# EAGLE design placa2caras_V1718 (EAGLE 7.6.0)
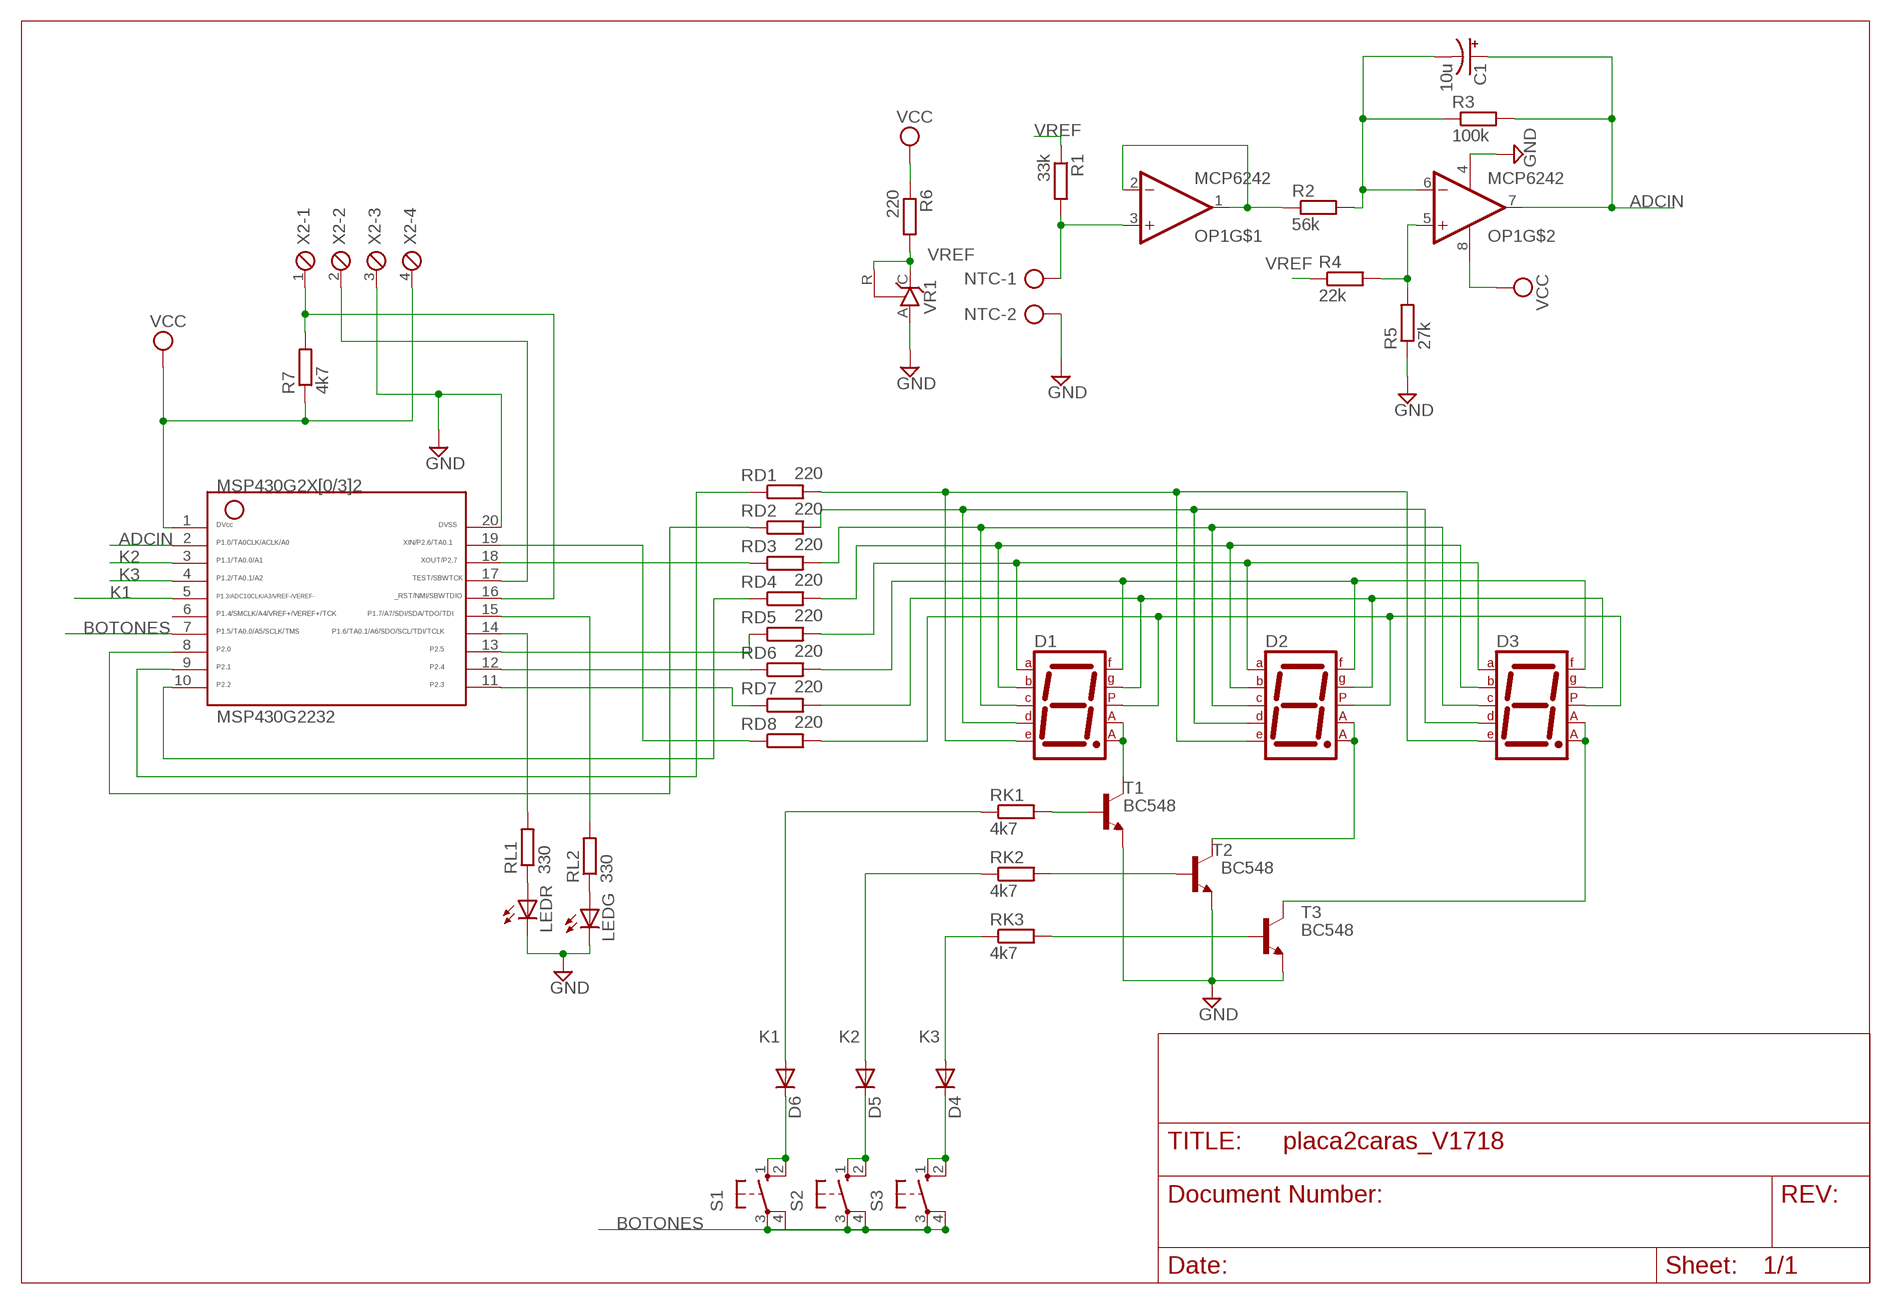
[diagram p0: schematic, sheet 1]

## Parts
C1  10u  CPOL-USE2,5-6E  [E2,5-6E]
D1  7SEG-CA  [7SEG-13]
D2  7SEG-CA  [7SEG-13]
D3  7SEG-CA  [7SEG-13]
D4  1N4148DO35-10  [DO35-10]
D5  1N4148DO35-10  [DO35-10]
D6  1N4148DO35-10  [DO35-10]
LEDG  LED5MM  [LED5MM]
LEDR  LED5MM  [LED5MM]
MSP430G2232  G2X[0/3]2---N20  [N20]
NTC  AK500/2  [AK500/2]
OP1  MCP6242  MCP6242CONPADGORDO  [DIL8_MOD]
R1  33k  R-EU_0207/10  [0207/10]
R2  56k  R-EU_0207/10  [0207/10]
R3  100k  R-EU_0207/10  [0207/10]
R4  22k  R-EU_0207/10  [0207/10]
R5  27k  R-EU_0207/10  [0207/10]
R6  220  R-EU_0207/10  [0207/10]
R7  4k7  R-EU_0207/10  [0207/10]
RD1  220  R-EU_0207/10  [0207/10]
RD2  220  R-EU_0207/10  [0207/10]
RD3  220  R-EU_0207/10  [0207/10]
RD4  220  R-EU_0207/10  [0207/10]
RD5  220  R-EU_0207/10  [0207/10]
RD6  220  R-EU_0207/10  [0207/10]
RD7  220  R-EU_0207/10  [0207/10]
RD8  220  R-EU_0207/10  [0207/10]
RK1  4k7  R-EU_0207/10  [0207/10]
RK2  4k7  R-EU_0207/10  [0207/10]
RK3  4k7  R-EU_0207/10  [0207/10]
RL1  330  R-EU_0207/10  [0207/10]
RL2  330  R-EU_0207/10  [0207/10]
S1  10-XX  [B3F-10XX]
S2  10-XX  [B3F-10XX]
S3  10-XX  [B3F-10XX]
T1  BC548  [TO92-EBC]
T2  BC548  [TO92-EBC]
T3  BC548  [TO92-EBC]
VR1  TL431CLP  [TO92-CLP]
X2  MPT4  [4POL254]

## Nets
ADCIN: C1.+ MSP430G2232.2 OP1.7(OUT) R3.2
BOTONES: MSP430G2232.7 S1.3(P) S1.4(P1) S2.3(P) S2.4(P1) S3.3(P) S3.4(P1)
GND: LEDG.K(C) LEDR.K(C) MSP430G2232.20 NTC.2 OP1.4(V-) R5.1 T1.E T2.E T3.E VR1.A X2.3
K1: D6.A MSP430G2232.5 RK1.1
K2: D5.A MSP430G2232.3 RK2.1
K3: D4.A MSP430G2232.4 RK3.1
N$1: RK1.2 T1.B
N$2: RK2.2 T2.B
N$3: RK3.2 T3.B
N$4: D1.7(A) D2.7(A) D3.7(A) RD5.2
N$5: D1.3(CA1) D1.8(CA2) T1.C
N$6: D1.6(B) D2.6(B) D3.6(B) RD4.2
N$7: D2.3(CA1) D2.8(CA2) T2.C
N$8: D1.4(C) D2.4(C) D3.4(C) RD3.2
N$9: D3.3(CA1) D3.8(CA2) T3.C
N$10: D1.2(D) D2.2(D) D3.2(D) RD2.2
N$11: MSP430G2232.17 X2.2
N$12: D1.1(E) D2.1(E) D3.1(E) RD1.2
N$13: OP1.5(+IN) R4.2 R5.2
N$14: D1.9(F) D2.9(F) D3.9(F) RD6.2
N$15: NTC.1 OP1.3(+IN) R1.2
N$16: D1.10(G) D2.10(G) D3.10(G) RD7.2
N$17: OP1.1(OUT) OP1.2(-IN) R2.1
N$18: D1.5(DP) D2.5(DP) D3.5(DP) RD8.2
N$19: C1.- OP1.6(-IN) R2.2 R3.1
N$20: MSP430G2232.16 R7.2 X2.1
N$21: MSP430G2232.19 RD8.1
N$22: MSP430G2232.18 RD3.1
N$23: MSP430G2232.13 RD5.1
N$24: MSP430G2232.12 RD6.1
N$25: MSP430G2232.11 RD7.1
N$26: MSP430G2232.10 RD4.1
N$27: MSP430G2232.9 RD1.1
N$28: MSP430G2232.8 RD2.1
N$29: D5.C S2.1(S) S2.2(S1)
N$30: D4.C S3.1(S) S3.2(S1)
N$31: D6.C S1.1(S) S1.2(S1)
N$32: MSP430G2232.15 RL2.2
N$33: LEDR.A RL1.1
N$34: MSP430G2232.14 RL1.2
N$35: LEDG.A RL2.1
VCC: MSP430G2232.1 OP1.8(V+) R6.1 R7.1 X2.4
VREF: R1.1 R4.1 R6.2 VR1.C VR1.R
Unconnected: MSP430G2232.6

## Library data of the parts
C1 = rcl:CPOL-US: POLARIZED CAPACITOR, American symbol
D1-D3 = special:7SEG-CA: 7-segment DISPLAY single anode, 13 mm
D4-D6 = diode:1N4148: DIODE high speed (Philips)
LEDG LEDR = led:LED: LED OSRAM: - CHIPLED LG R971, LG N971, LY N971, LG Q971, LY Q971, LO R971, LY R971 LH N974, LH R974 LS Q976, LO Q976, LY Q976 LO Q996 - Hyper CHIPLED LW Q18S LB Q993, LB Q99A, LB R99A - SideLED LS A670, LO A670, LY A670, LG A670, LP A670 LB A673, LV A673, LT A673, LW A673 LH A674 LY A675 LS A676, LA A676, LO A676, LY A676, LW A676 LS A679, LY A679, LG A679 - Hyper Micro SIDELED® LS Y876, LA Y876, LO Y876, LY Y876 LT Y87S - SmartLED LW L88C, LW L88S LB L89C, LB L89S, LG L890 LS L89K, LO L89K, LY L89K LS L896, LA L896, LO L896, LY L896 - TOPLED LS T670, LO T670, LY T670, LG T670, LP T670 LSG T670, LSP T670, LSY T670, LOP T670, LYG T670 LG T671, LOG T671, LSG T671 LB T673, LV T673, LT T673, LW T673 LH T674 LS T676, LA T676, LO T676, LY T676, LB T676, LH T676, LSB T676, LW T676 LB T67C, LV T67C, LT T67C, LS T67K, LO T67K, LY T67K, LW E67C LS E67B, LA E67B, LO E67B, LY E67B, LB E67C, LV E67C, LT E67C LW T67C LS T679, LY T679, LG T679 LS T770, LO T770, LY T770, LG T770, LP T770 LB T773, LV T773, LT T773, LW T773 LH T774 LS E675, LA E675, LY E675, LS T675 LS T776, LA T776, LO T776, LY T776, LB T776 LHGB T686 LT T68C, LB T68C - Hyper Mini TOPLED® LB M676 - Mini TOPLED Santana® LG M470 LS M47K, LO M47K, LY M47K Source: http://www.osram.convergy.de LUXEON: - LUMILED® LXK2-PW12-R00, LXK2-PW12-S00, LXK2-PW14-U00, LXK2-PW14-V00 LXK2-PM12-R00, LXK2-PM12-S00, LXK2-PM14-U00 LXK2-PE12-Q00, LXK2-PE12-R00, LXK2-PE12-S00, LXK2-PE14-T00, LXK2-PE14-U00 LXK2-PB12-K00, LXK2-PB12-L00, LXK2-PB12-M00, LXK2-PB14-N00, LXK2-PB14-P00, LXK2-PB14-Q00 LXK2-PR12-L00, LXK2-PR12-M00, LXK2-PR14-Q00, LXK2-PR14-R00 LXK2-PD12-Q00, LXK2-PD12-R00, LXK2-PD12-S00 LXK2-PH12-R00, LXK2-PH12-S00 LXK2-PL12-P00, LXK2-PL12-Q00, LXK2-PL12-R00 Source: www.luxeon.com KINGBRIGHT: KA-3528ASYC Source: www.kingbright.com
MSP430G2232 = TI_MSP430_v16:G2X[0/3]2---N20: MSP430G2X[0/3]2 MSP430G2x32, MSP430G2x02 PDIP (N) 20 Pin Package http://focus.ti.com/docs/prod/folders/print/msp430g2432.html
NTC = con-ptr500:AK500/2: CONNECTOR; OC_FARNELL: unknown; OC_NEWARK: unknown
OP1 = linear:MCP6242: Opamp de Microchip. Rail to rail, 3V
R1-R7 RD1-RD8 RK1-RK3 RL1 RL2 = resistor_mod2:R-EU_: RESISTOR, European symbol
S1-S3 = switch-omron:10-XX: OMRON SWITCH; MPN: B3F-1000; OC_FARNELL: 176432; OC_NEWARK: 36M3542
T1-T3 = transistor-npn:BC548*: NPN Transistor
VR1 = v-reg:TL431CLP: VOLTAGE REGULATOR
X2 = con-phoenix-254:MPT4: PHOENIX CONNECTOR; OC_FARNELL: unknown; OC_NEWARK: unknown

## Board
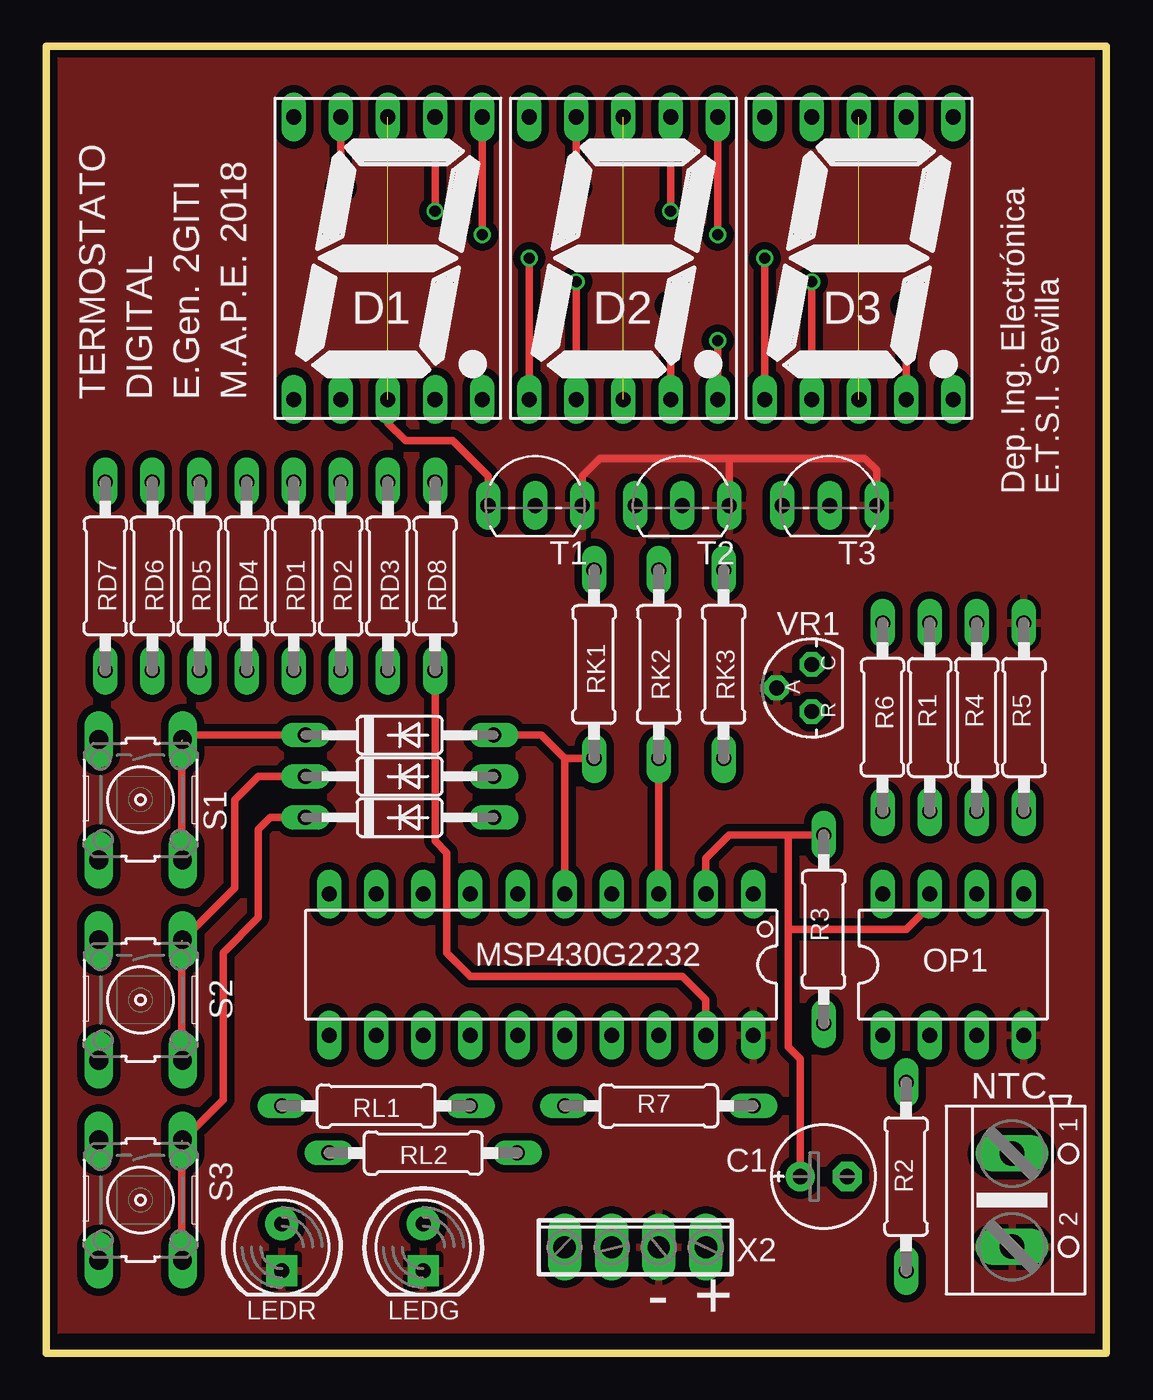
[diagram p1: board, top side]
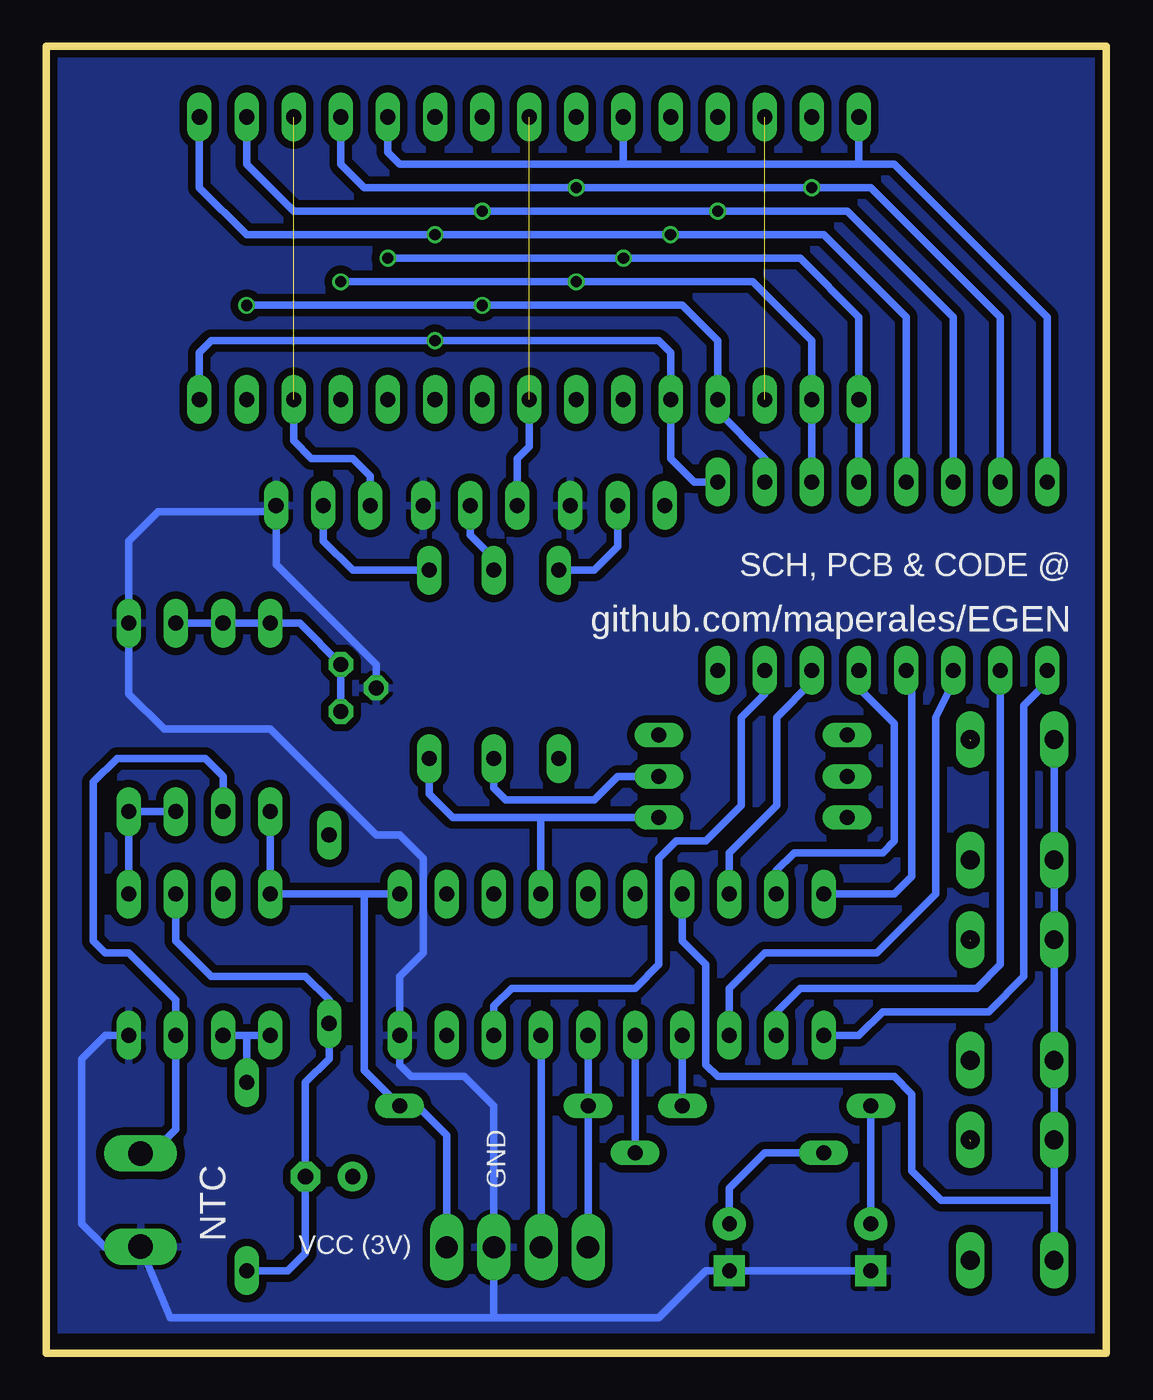
[diagram p2: board, bottom side, seen from below]

Size 57.15 x 70.48 mm. Coordinates in mm from the lower left corner, seen from the top.
Outline: 0,70.48 57.15,70.48 57.15,0 0,0 0,70.48
Copper layers (1*16): Top 0.035mm / dielectric 1.5mm / Bottom 0.035mm
Design rules "SeeedStudio_2layer_DRU_no_angle_20140221": minimum track width 6mil, minimum drill 12mil, track to track 6mil, track to pad 6mil, pad to pad 6mil, via to via 6mil, smd to smd 0mil, copper to edge 10mil, drill to drill 10mil, minimum pad ring 10mil, minimum via ring 6mil, stop-mask expansion 2mil, vias tented up to drill 100mil, thermal gap 10mil

### Footprints (pad centres in the part's own frame; a part is rotated, then mirrored left to right if it is on the bottom)
E2,5-6E = drill 0.813 pad 1.575: + -1.27,0 | drill 0.813 pad 1.575 octagon: - 1.27,0
7SEG-13 = drill 0.813 long: 1 -5.08,-7.62; 2 -2.54,-7.62; 3 0,-7.62; 4 2.54,-7.62; 5 5.08,-7.62; 6 5.08,7.62; 7 2.54,7.62; 8 0,7.62; 9 -2.54,7.62; 10 -5.08,7.62
DO35-10 = drill 0.813 long: A 5.08,0; C -5.08,0
LED5MM = drill 0.8 pad 1.778: A -1.27,0 | drill 0.8 pad 1.676 square: K 1.27,0
N20 = drill 0.813 long: 1 -11.435,-3.81; 2 -8.895,-3.81; 3 -6.355,-3.81; 4 -3.815,-3.81; 5 -1.275,-3.81; 6 1.265,-3.81; 7 3.805,-3.81; 8 6.345,-3.81; 9 8.885,-3.81; 10 11.425,-3.81; 11 11.425,3.81; 12 8.885,3.81; 13 6.345,3.81; 14 3.805,3.81; 15 1.265,3.81; 16 -1.275,3.81; 17 -3.815,3.81; 18 -6.355,3.81; 19 -8.895,3.81; 20 -11.435,3.81
AK500/2 = drill 1.321 long: 1 -2.515,0; 2 2.515,0
DIL8_MOD = drill 0.813 pad 1.27 long: 1 -6.35,-3.81; 2 -3.81,-3.81; 3 -1.27,-3.81; 4 1.27,-3.81; 5 1.27,3.81; 6 -1.27,3.81; 7 -3.81,3.81; 8 -6.35,3.81
0207/10 = drill 0.813 long: 1 -5.08,0; 2 5.08,0
B3F-10XX = drill 1.016 long: 1 -3.251,2.261; 2 3.251,2.261; 3 -3.251,-2.261; 4 3.251,-2.261
TO92-EBC = drill 0.813 long: B 0,-1.27; C -2.54,-1.27; E 2.54,-1.27
TO92-CLP = drill 0.813 octagon: A 0,1.905; C 1.27,0; R -1.27,0
4POL254 = drill 1.2 long: 1 -3.81,0; 2 -1.27,0; 3 1.27,0; 4 3.81,0

### Placement (x,y rotation side)
C1  41.91,9.52 0 top
D1  18.41,59.05 0 top
D2  31.12,59.05 0 top
D3  43.81,59.05 0 top
D4  19.05,28.89 0 top
D5  19.05,31.11 0 top
D6  19.05,33.34 0 top
LEDG  20.32,5.72 270 top
LEDR  12.7,5.72 270 top
MSP430G2232  26.67,20.95 180 top
NTC  52.07,8.25 270 top
OP1  51.44,20.95 0 top
R1  47.62,34.29 270 top
R2  46.35,9.52 270 top
R3  41.91,22.86 90 top
R4  50.16,34.29 270 top
R5  52.7,34.29 270 top
R6  45.09,34.29 90 top
R7  33.02,13.34 180 top
RD1  13.34,41.91 90 top
RD2  15.88,41.91 90 top
RD3  18.41,41.91 90 top
RD4  10.79,41.91 90 top
RD5  8.25,41.91 90 top
RD6  5.71,41.91 90 top
RD7  3.17,41.91 90 top
RD8  20.95,41.91 90 top
RK1  29.53,37.15 90 top
RK2  33.02,37.15 90 top
RK3  36.51,37.15 90 top
RL1  17.78,13.34 0 top
RL2  20.32,10.8 0 top
S1  5.08,29.85 270 top
S2  5.08,19.05 270 top
S3  5.08,8.25 270 top
T1  26.35,46.99 0 top
T2  34.29,46.99 0 top
T3  42.23,46.99 0 top
VR1  41.27,35.88 90 top
X2  31.75,5.72 0 top

### Tracks (layer width: path | path; a pad name or v marks a point on that pad's centre or on a via)
ADCIN
  Top 0.406: MSP430G2232.2 35.56,26.68 36.83,27.94 40.01,27.94 | 40.01,22.86 40.01,16.51 40.64,15.88 C1.+ | 40.01,22.86 40.01,27.94 | OP1.7 47.62,24.13 46.35,22.86 40.01,22.86 | R3.2 40.01,27.94
BOTONES
  Bottom 0.406: MSP430G2232.7 22.86,22.23 21.59,20.95 21.59,15.56 20.95,14.92 11.43,14.92 10.48,13.97 10.48,9.84 8.89,8.25 2.82,8.25 | 2.82,8.25 S3.3 S2.4 S2.3 S1.4 S1.3 | 2.82,8.25 S3.4
GND
  Top 0.406: T1.E 28.89,47.31 29.84,48.26 36.83,48.26 | 36.83,48.26 44.13,48.26 44.77,47.62 T3.E | T2.E 36.83,48.26
  Bottom 0.406: LEDR.K LEDG.K 21.59,4.45 24.13,1.91 33.02,1.91 | 33.02,1.91 X2.3 33.02,13.34 34.61,14.92 37.46,14.92 38.1,15.56 MSP430G2232.20 38.1,20.32 36.83,21.59 36.83,26.67 38.1,27.94 39.37,27.94 45.09,33.66 50.8,33.66 52.7,35.56 R5.1 52.7,43.82 51.12,45.4 45.09,45.4 T3.E 44.77,42.55 39.37,37.15 VR1.A | 33.02,1.91 50.48,1.91 52.07,5.72 NTC.2 52.09,5.72 53.98,5.72 55.24,6.99 55.24,15.88 53.98,17.14 OP1.4
  pour Bottom (isolate 0.406): 0.63,69.85 56.52,69.85 56.52,1.27 0.63,1.27
  pour Top (isolate 0.406): 0.63,69.85 56.52,69.85 56.52,1.27 0.63,1.27
K1
  Top 0.406: MSP430G2232.5 27.95,32.06 | 27.95,32.06 27.95,32.07 RK1.1 | 27.95,32.06 26.67,33.34 D6.A
K2
  Top 0.406: MSP430G2232.3 33.02,31.11 RK2.1
  Bottom 0.406: D5.A 26.35,31.11 27.62,29.85 32.39,29.85 33.02,30.48 RK2.1
K3
  Bottom 0.406: MSP430G2232.4 30.48,28.89 D4.A 35.24,28.89 36.51,30.16 RK3.1
N$1
  Bottom 0.406: RK1.2 27.62,42.23 26.35,43.5 T1.B
N$2
  Bottom 0.406: RK2.2 33.02,42.86 34.29,44.13 T2.B
N$3
  Bottom 0.406: RK3.2 40.64,42.23 42.23,43.82 T3.B
N$4  (via drill 0.6)
  Top 0.406: D1.7 v20.95,61.59 | D2.7 v33.66,61.59
  Bottom 0.406: D3.7 46.35,64.14 43.81,61.59 v33.66,61.59 v20.95,61.59 13.97,61.59 8.25,55.88 RD5.2
N$5  (1 unrouted)
  Top 0.406: T1.C 23.81,47.31 21.91,49.21 19.37,49.21 18.41,50.17 D1.3
N$6  (via drill 0.6)
  Top 0.406: D1.6 v23.5,60.33 | D2.6 v36.2,60.33
  Bottom 0.406: D3.6 48.9,62.87 46.35,60.33 v36.2,60.33 v23.5,60.33 15.24,60.33 10.79,55.88 RD4.2
N$7  (1 unrouted)
  Bottom 0.406: T2.C 31.75,48.26 31.12,48.9 D2.3
N$8  (via drill 0.6)
  Top 0.406: D2.4 v33.66,56.52 | D3.4 v46.35,56.52
  Bottom 0.406: v46.35,56.52 v33.66,56.52 22.86,56.52 20.95,54.61 D1.4 20.95,50.8 18.41,48.26 RD3.2
N$9  (1 unrouted)
  Bottom 0.406: T3.C 39.69,47.31 40.64,48.26 42.86,48.26 43.81,49.21 D3.3
N$10  (via drill 0.6)
  Top 0.406: D2.2 v28.58,57.79 | D3.2 v41.27,57.79
  Bottom 0.406: v41.27,57.79 v28.58,57.79 19.05,57.79 15.88,54.61 D1.2 RD2.2
N$11
  Bottom 0.406: 30.5,17.13 MSP430G2232.17 X2.2
N$12  (via drill 0.6)
  Top 0.406: D2.1 v26.04,59.05 | D3.1 v38.73,59.05
  Bottom 0.406: v38.73,59.05 v26.04,59.05 16.51,59.05 13.34,55.88 D1.1 RD1.2
N$13
  Bottom 0.406: OP1.5 R5.2 R4.2
N$14  (via drill 0.6)
  Top 0.406: D1.9 v15.88,62.87 | D2.9 v28.58,62.87
  Bottom 0.406: D3.9 41.27,64.14 40.01,62.87 v28.58,62.87 v15.88,62.87 12.7,62.87 5.71,55.88 RD6.2
N$15
  Bottom 0.406: NTC.1 52.05,10.8 51.44,10.8 50.16,12.07 OP1.3 50.16,19.05 52.7,21.59 53.98,21.59 54.61,22.22 54.61,30.8 53.34,32.07 48.58,32.07 47.62,31.11 R1.2
N$16
  Bottom 0.406: 13.34,64.14 11.43,64.14 3.17,55.88 RD7.2 | D1.10 13.34,64.14 | 13.34,64.14 26.04,64.14 | 26.04,64.14 D2.10 | D3.10 38.73,64.77 38.1,64.14 26.04,64.14
N$17
  Bottom 0.406: OP1.2 46.35,17.14 | 46.35,17.14 OP1.1 | R2.1 46.35,17.14
N$18  (via drill 0.6)
  Top 0.406: D2.5 v36.2,54.61
  Bottom 0.406: D3.5 48.9,53.98 48.26,54.61 v36.2,54.61 24.13,54.61 23.5,53.98 D1.5 23.5,48.26 22.23,46.99 RD8.2
N$19
  Bottom 0.406: OP1.6 50.16,22.22 48.26,20.32 43.18,20.32 41.91,19.05 R3.1 41.91,15.88 43.18,14.61 C1.- 43.18,5.4 44.13,4.45 R2.2
N$20
  Bottom 0.406: MSP430G2232.16 R7.2 X2.1
N$21
  Top 0.406: RD8.1 20.95,27.62 21.59,26.99 21.59,21.59 22.86,20.32 34.29,20.32 35.56,19.05 MSP430G2232.19
N$22
  Bottom 0.406: RD3.1 18.41,35.56 19.68,34.29 19.68,29.53 21.59,27.62 23.18,27.62 24.13,26.67 24.13,20.95 25.4,19.68 32.07,19.68 33.02,18.73 MSP430G2232.18
N$23
  Bottom 0.406: MSP430G2232.13 20.32,19.68 18.41,21.59 12.38,21.59 9.21,24.77 9.21,34.29 8.25,36.2 RD5.1
N$24
  Bottom 0.406: RD6.1 5.71,20.95 6.98,19.68 16.51,19.68 17.78,18.41 MSP430G2232.12
N$25
  Bottom 0.406: RD7.1 3.17,36.2 4.45,34.93 4.45,20.32 6.35,18.41 12.07,18.41 13.34,17.14 MSP430G2232.11
N$26
  Bottom 0.406: RD4.1 10.48,36.2 10.48,25.72 11.43,24.77 MSP430G2232.10
N$27
  Bottom 0.406: MSP430G2232.9 17.79,26.03 16.83,26.99 12.07,26.99 11.43,27.62 11.43,33.97 13.34,35.88 RD1.1
N$28
  Bottom 0.406: RD2.1 15.88,36.2 17.78,34.29 17.78,29.53 20.32,26.99 MSP430G2232.8
N$29  (1 unrouted)
  Top 0.406: D5.C 11.43,31.11 10.16,29.85 10.16,25.08 7.3,22.22 7.3,16.08 S2.2
N$30  (1 unrouted)
  Top 0.406: D4.C 12.07,28.89 11.43,28.26 11.43,23.5 9.53,21.59 9.53,13.65 7.3,11.43 7.3,5.28 S3.2
N$31  (1 unrouted)
  Top 0.406: D6.C 7.62,33.34 7.3,33.02 7.3,26.87 S1.2
N$32
  Bottom 0.406: RL2.2 MSP430G2232.15
N$33
  Bottom 0.406: LEDR.A RL1.1
N$34
  Bottom 0.406: MSP430G2232.14 22.86,13.97 RL1.2
N$35
  Bottom 0.406: RL2.1 18.41,10.8 20.32,8.89 LEDG.A
VCC
  Bottom 0.406: 40.01,24.77 OP1.8 R6.1 | 40.01,24.77 MSP430G2232.1 | 40.01,24.77 40.01,15.24 R7.1 37.15,13.34 35.56,11.75 X2.4
VREF
  Bottom 0.406: R4.1 R1.1 R6.2 43.5,39.37 VR1.C VR1.R

### Text on the board
tNames: TERMOSTATO | DIGITAL | E.Gen. 2GITI | M.A.P.E. 2018 | Dep. Ing. Electrónica / E.T.S.I. Sevilla | - | +
bNames: SCH, PCB & CODE @ | github.com/maperales/EGEN | NTC | GND | VCC (3V)